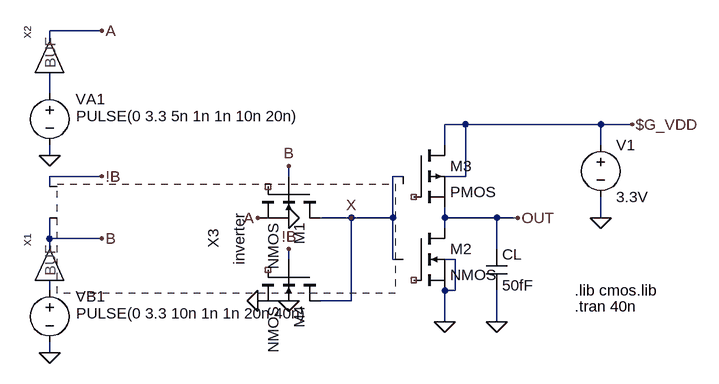
[diagram p0: schematic nmos_only_nonrestoring tb.asc]
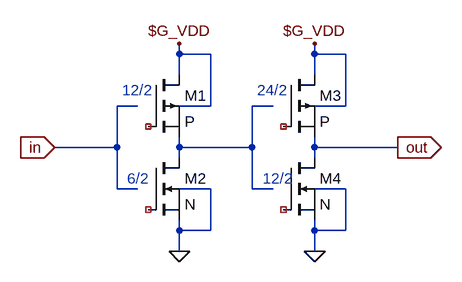
[diagram p1: sub-circuit buf.asc]
nmos_only_nonrestoring tb.asc, the LTspice schematic file:
Version 4
SHEET 1 1292 680
WIRE -1712 -512 -1792 -512
WIRE -1792 -496 -1792 -512
WIRE -1792 -416 -1792 -448
WIRE -1152 -368 -1184 -368
WIRE -944 -368 -1152 -368
WIRE -896 -368 -944 -368
WIRE -1184 -336 -1184 -368
WIRE -944 -336 -944 -368
WIRE -1792 -320 -1792 -336
WIRE -1712 -288 -1792 -288
WIRE -1424 -288 -1424 -304
WIRE -1248 -288 -1264 -288
WIRE -1152 -288 -1152 -368
WIRE -1152 -288 -1184 -288
WIRE -1792 -272 -1792 -288
WIRE -1328 -224 -1376 -224
WIRE -1264 -224 -1264 -288
WIRE -1264 -224 -1328 -224
WIRE -1184 -224 -1184 -240
WIRE -1104 -224 -1184 -224
WIRE -1072 -224 -1104 -224
WIRE -944 -224 -944 -256
WIRE -1184 -208 -1184 -224
WIRE -1792 -192 -1792 -224
WIRE -1712 -192 -1792 -192
WIRE -1792 -176 -1792 -192
WIRE -1104 -176 -1104 -224
WIRE -1424 -160 -1424 -176
WIRE -1264 -160 -1264 -224
WIRE -1248 -160 -1264 -160
WIRE -1168 -160 -1184 -160
WIRE -1792 -112 -1792 -128
WIRE -1168 -112 -1168 -160
WIRE -1168 -112 -1184 -112
WIRE -1328 -96 -1328 -224
WIRE -1328 -96 -1376 -96
WIRE -1184 -64 -1184 -112
WIRE -1104 -64 -1104 -112
WIRE -1792 -16 -1792 -32
FLAG -944 -224 0
FLAG -1104 -64 0
FLAG -1424 -224 0
FLAG -1184 -64 0
FLAG -1072 -224 OUT
FLAG -1328 -224 X
FLAG -896 -368 $G_VDD
FLAG -1792 -320 0
FLAG -1712 -512 A
FLAG -1792 -16 0
FLAG -1712 -192 B
FLAG -1424 -304 B
FLAG -1472 -224 A
FLAG -1712 -288 !B
FLAG -1424 -96 0
FLAG -1424 -176 !B
FLAG -1472 -96 0
SYMBOL voltage -944 -352 R0
WINDOW 123 0 0 Left 2
WINDOW 39 0 0 Left 2
SYMATTR InstName V1
SYMATTR Value 3.3V
SYMBOL cap -1120 -176 R0
SYMATTR InstName CL
SYMATTR Value 50fF
SYMBOL nmos -1376 -272 R90
SYMATTR InstName M1
SYMATTR Value2 l=0.6u w=1.5u
SYMATTR Value NMOS
SYMBOL nmos -1232 -208 R0
SYMATTR InstName M2
SYMATTR Value2 l=0.6u w=3u
SYMATTR Value NMOS
SYMBOL pmos -1232 -336 R0
SYMATTR InstName M3
SYMATTR Value2 l=0.6u w=6u
SYMATTR SpiceModel ""
SYMATTR Value PMOS
SYMBOL voltage -1792 -432 R0
WINDOW 123 0 0 Left 2
WINDOW 39 0 0 Left 2
WINDOW 3 41 51 Left 2
WINDOW 0 40 25 Left 2
SYMATTR Value PULSE(0 3.3 5n 1n 1n 10n 20n)
SYMATTR InstName VA1
SYMBOL voltage -1792 -128 R0
WINDOW 123 0 0 Left 2
WINDOW 39 0 0 Left 2
WINDOW 3 41 51 Left 2
WINDOW 0 40 25 Left 2
SYMATTR Value PULSE(0 3.3 10n 1n 1n 20n 40n)
SYMATTR InstName VB1
SYMBOL buf -1792 -464 R270
SYMATTR InstName X2
SYMBOL buf -1792 -144 R270
SYMATTR InstName X1
SYMBOL inverter -1792 -240 R270
SYMATTR InstName X3
SYMBOL nmos -1376 -144 R90
SYMATTR InstName M4
SYMATTR Value2 l=0.6u w=1.5u
SYMATTR Value NMOS
TEXT -984 -88 Left 2 !.tran 40n
TEXT -984 -112 Left 2 !.lib cmos.lib

buf.asc, the sub-circuit schematic file:
Version 4
SHEET 1 1292 836
WIRE -624 -80 -624 -96
WIRE -576 -80 -624 -80
WIRE -416 -80 -416 -96
WIRE -368 -80 -416 -80
WIRE -624 -48 -624 -80
WIRE -416 -48 -416 -80
WIRE -688 0 -720 0
WIRE -576 0 -576 -80
WIRE -576 0 -624 0
WIRE -480 0 -512 0
WIRE -368 0 -368 -80
WIRE -368 0 -416 0
WIRE -720 64 -720 0
WIRE -720 64 -816 64
WIRE -624 64 -624 48
WIRE -512 64 -512 0
WIRE -512 64 -624 64
WIRE -416 64 -416 48
WIRE -288 64 -416 64
WIRE -624 80 -624 64
WIRE -416 80 -416 64
WIRE -720 128 -720 64
WIRE -688 128 -720 128
WIRE -576 128 -624 128
WIRE -512 128 -512 64
WIRE -480 128 -512 128
WIRE -368 128 -416 128
WIRE -624 192 -624 176
WIRE -576 192 -576 128
WIRE -576 192 -624 192
WIRE -416 192 -416 176
WIRE -368 192 -368 128
WIRE -368 192 -416 192
WIRE -624 224 -624 192
WIRE -416 224 -416 192
FLAG -624 224 0
FLAG -816 64 in
IOPIN -816 64 In
FLAG -288 64 out
IOPIN -288 64 Out
FLAG -624 -96 $G_VDD
FLAG -416 224 0
FLAG -416 -96 $G_VDD
SYMBOL pmos -672 -48 R0
SYMATTR InstName M1
SYMATTR Value2 L=0.6U W=7.2U AS=4.86P AD=13.005P PS=7.2U PD=20.7U
SYMATTR SpiceModel ""
SYMATTR Value P
SYMBOL nmos -672 80 R0
SYMATTR InstName M2
SYMATTR Value2 L=0.6U W=3.6U AS=4.86P AD=7.065P PS=7.2U PD=13.5U
SYMATTR Value N
SYMBOL pmos -464 -48 R0
SYMATTR InstName M3
SYMATTR Value2 l=0.6U w=7.2U ad=13.005P as=4.86P pd=20.7U ps=7.2U m=2
SYMATTR SpiceModel ""
SYMATTR Value P
SYMBOL nmos -464 80 R0
SYMATTR InstName M4
SYMATTR Value2 l=0.6U w=3.6U ad=7.065P as=4.86P pd=13.5U ps=7.2U m=2
SYMATTR Value N
TEXT -712 -24 Left 2 ;12/2
TEXT -704 112 Left 2 ;6/2
TEXT -504 -24 Left 2 ;24/2
TEXT -496 112 Left 2 ;12/2

The netlist it stands for:
* nmos_only_nonrestoring tb.asc
V1 $G_VDD 0 3.3V
CL OUT 0 50fF
M1 X NC_01 A A NMOS l=0.6u w=1.5u
* M2: NMOS l=0.6u w=3u (symbol nmos not certain, pin order unknown); nets seen at it: 0, OUT
* M3: PMOS l=0.6u w=6u (symbol pmos not certain, pin order unknown); nets seen at it: $G_VDD, OUT
VA1 N001 0 PULSE(0 3.3 5n 1n 1n 10n 20n)
VB1 N002 0 PULSE(0 3.3 10n 1n 1n 20n 40n)
XX2 N001 A buf
XX1 N002 B buf
* X3: inverter (symbol inverter not available, pin order unknown); nets seen at it: !B, 0, B, X
M4 X NC_04 0 0 NMOS l=0.6u w=1.5u

* block symbol definitions
.subckt buf in out
* M1: P L=0.6U W=7.2U AS=4.86P AD=13.005P PS=7.2U PD=20.7U (symbol pmos not certain, pin order unknown); nets seen at it: $G_VDD, N001
* M2: N L=0.6U W=3.6U AS=4.86P AD=7.065P PS=7.2U PD=13.5U (symbol nmos not certain, pin order unknown); nets seen at it: 0, N001
* M3: P l=0.6U w=7.2U ad=13.005P as=4.86P pd=20.7U ps=7.2U m=2 (symbol pmos not certain, pin order unknown); nets seen at it: $G_VDD, out
* M4: N l=0.6U w=3.6U ad=7.065P as=4.86P pd=13.5U ps=7.2U m=2 (symbol nmos not certain, pin order unknown); nets seen at it: 0, out
* 12/2
* 6/2
* 24/2
* 12/2
.ends buf

.model NMOS NMOS
.model PMOS PMOS
.lib standard.mos
.tran 40n
.lib cmos.lib
.backanno
.end